# Altium schematic sheet Input_Output.SchDoc: Motherboard-Input_Output
size A4; Author: Patryk Bujak; DrawnBy: Patryk Bujak; DocumentNumber: 12; Revision: 1.0; SheetNumber: 4; SheetTotal: 10
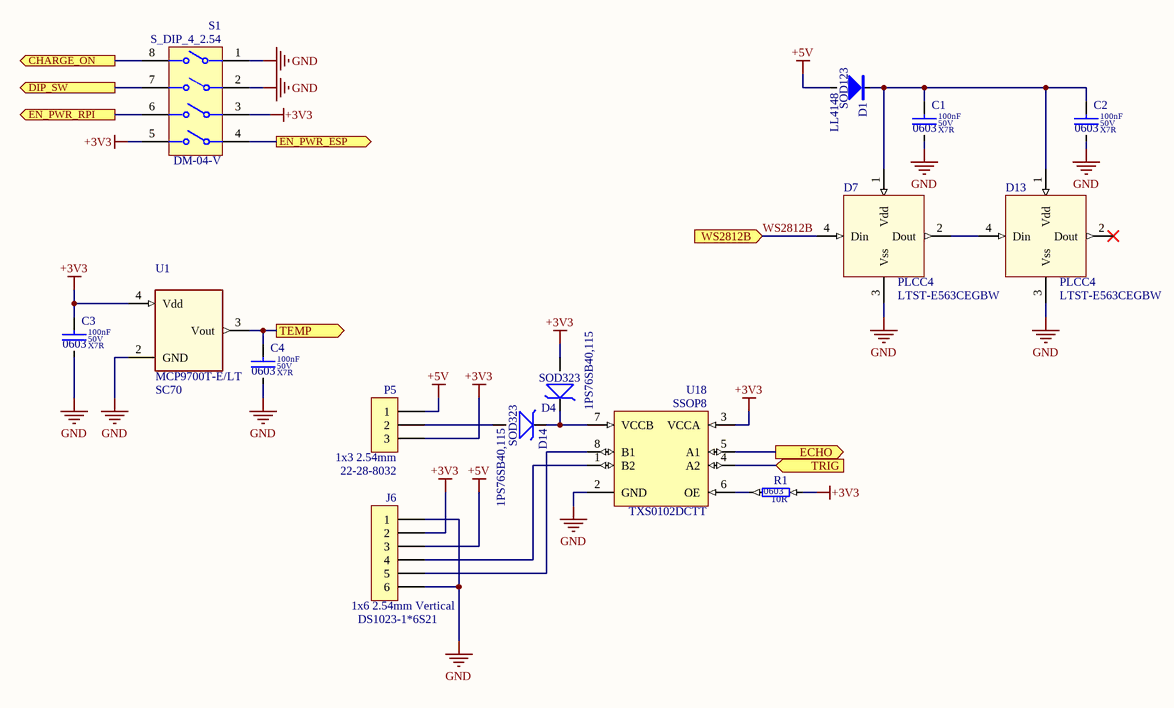
[diagram p0: Input_Output.SchDoc]

## Parts
C1  value 100nF  Dielectric: X7R  Voltage: 50V  SCH_Footprint: 0603  [C_0603_1608]  (hidden comment: Ceramic X7R)
C2  value 100nF  Dielectric: X7R  Voltage: 50V  SCH_Footprint: 0603  [C_0603_1608]  (hidden comment: Ceramic X7R)
C3  value 100nF  Dielectric: X7R  Voltage: 50V  SCH_Footprint: 0603  [C_0603_1608]  (hidden comment: Ceramic X7R)
C4  value 100nF  Dielectric: X7R  Voltage: 50V  SCH_Footprint: 0603  [C_0603_1608]  (hidden comment: Ceramic X7R)
D1  value LL4148  [SOD123]  (hidden comment: 1N4148W)
D4  value 1PS76SB40,115  [SOD323]  (hidden comment: 1PS76SB40)
D7  value LTST-E563CEGBW  SCH_Footprint: PLCC4  [PLCC4_5050]  (hidden comment: SMD LED with built-in embedded IC)
D13  value LTST-E563CEGBW  SCH_Footprint: PLCC4  [PLCC4_5050]  (hidden comment: SMD LED with built-in embedded IC)
D14  value 1PS76SB40,115  [SOD323]  (hidden comment: 1PS76SB40)
J6  value DS1023-1*6S21  SCH_Footprint: 1x6 2.54mm Vertical  [J_HEADER_1x6_2.54_VERTICAL]  (hidden comment: Goldpin female straight)
P5  value 22-28-8032  SCH_Footprint: 1x3 2.54mm  [P_HEADER_1x3_2.54_ANGLE]  (hidden comment: Goldpin)
R1  value 10R  SCH_Footprint: 0603  [R_0603_1608]  (hidden comment: Resistor)
S1  value DM-04-V  SCH_Footprint: S_DIP_4_2.54  [DM-04-V]  (hidden comment: DIP SWITCH 4 POS)
U1  SCH_Footprint: SC70  [SC70-5_SOT353_TSSOP5]  (hidden comment: MCP9700T-E/LT)
U18  value TXS0102DCTT  SCH_Footprint: SSOP8  [SSOP8_3x3]  (hidden comment: 2-Bit Bidirectional Voltage-Level Shifter for Open-Drain and Push-Pull Application 8-VSSOP -40 to 85)

## Ports
CHARGE_ON (out), DIP_SW (out), ECHO (out), EN_PWR_ESP (out), EN_PWR_RPI (out), TEMP (out), TRIG (in), WS2812B (in)

## Nets
+3V3: C3.1 D4.2 J6.2 P5.3 R1.1 S1.3 S1.5 U1.4(Vdd) U18.3(VCCA)
+5V: D1.2 J6.3 P5.1
GND: C1.2 C2.2 C3.2 C4.2 D7.3(Vss) D13.3(Vss) J6.1 J6.6 S1.1 S1.2 U1.2(GND) U18.2(GND)
CHARGE_ON: S1.8 ; port CHARGE_ON
DIP_SW: S1.7 ; port DIP_SW
ECHO: U18.5(A1) ; port ECHO
EN_PWR_ESP: S1.4 ; port EN_PWR_ESP
EN_PWR_RPI: S1.6 ; port EN_PWR_RPI
TEMP: C4.1 U1.3(Vout) ; port TEMP
TRIG: U18.4(A2) ; port TRIG
WS2812B: D7.4(Din) ; port WS2812B
NetC1_1: C1.1 C2.1 D1.1 D7.1(Vdd) D13.1(Vdd)
NetD4_1: D4.1 D14.1 U18.7(VCCB)
NetD7_2: D7.2(Dout) D13.4(Din)
NetD14_2: D14.2 P5.2
NetJ6_4: J6.4 U18.1(B2)
NetJ6_5: J6.5 U18.8(B1)
NetR1_2: R1.2 U18.6(OE)

Not connected (* = marked no-connect by the designer): D13 2(Dout)*

## Notes on the sheet
- Title
- Size:
- Date:
- A4
- Number:
- Time:
- Revision:
- Sheet
- of
- File:

## Library data of the parts
C1-C4 = C_100nF_50V_X7R_0603_5: Capacitor; Manufacturer: Samsung; Manufacturer Part Number: CL10B104JB8NNNC; Tolerance (%): 5; Part Number: C_100nF_50V_X7R_0603_5; HelpURL: http://www.tme.eu/pl/Document/4a42202b32dab16128fe107dd69598cc/samsung-chip-cap.pdf; Supplier 1: TME; Supplier Part Number 1: CL10B104JB8NNNC; Supplier 2: RS Components; Supplier Part Number 2: 7665455; Supplier 3: Farnell; Supplier 4: Mouser; Supplier 5: Digi-Key; Supplier Part Number 5: 1276-1033-1-ND; Supplier 6: LCSC; Supplier Part Number 6: C24452
D1 = D_1N4148W_0A15_75V_SOD123: Manufacturer: Fairchild Semiconductor; Voltage: 75V; Current: 0.15A; SCH_Footprint: SOD123; Part Number: D_1N4148W_0A15_75V_SOD123; Manufacturer Part Number: LL4148; Supplier 1: TME; Supplier 2: RS Components; Supplier 3: Farnell; Supplier 4: Mouser; Supplier Part Number 4: 771-PMLL4148L-T/R; Supplier 5: Digi-Key; Supplier Part Number 5: LL4148FSCT; Supplier 6: LCSC
D4 D14 = DS_1PS76SB40_40V_SOD323: Manufacturer: Nexperia; Voltage: 40V; Current: 120mA; SCH_Footprint: SOD323; Part Number: DS_1PS76SB40_40V_SOD323; HelpURL: https://datasheet.octopart.com/BAS40H%2C115-Nexperia-datasheet-8446890.pdf; Manufacturer Part Number: 1PS76SB40,115; Supplier 1: TME; Supplier Part Number 1: 1PS76SB40.115; Supplier 2: RS Components; Supplier Part Number 2: 509419; Supplier 3: Farnell; Supplier Part Number 3: 1349646; Supplier 4: Mouser; Supplier Part Number 4: 771-1PS76SB40115; Supplier 5: Digi-Key; Supplier Part Number 5: 1727-1187-1-ND; Supplier 6: LCSC
D7 D13 = OL_LTST-E563CEGBW: Manufacturer: Lite-On; Part Number: OL_LTST-E563CEGBW; HelpURL: https://www.tme.eu/Document/594934e57b4d934542266695a36c177d/AN500301_v3.0.pdf; Manufacturer Part Number: LTST-E563CEGBW; Supplier 1: TME; Supplier Part Number 1: LTST-E563CEGBW; Supplier 2: RS Components; Supplier 3: Farnell; Supplier 4: Mouser; Supplier Part Number 4: 859-LTST-E563CEGBW; Supplier 5: Digi-Key; Supplier Part Number 5: 160-2264-1-ND; Supplier 6: LCSC
J6 = J_HEADER_1x6_2.54_VERTICAL: Pin Header; Manufacturer: Connfly; Part Number: J_HEADER_1x6_2.54_VERTICAL; HelpURL: https://www.tme.eu/Document/584b1a60cf2e8809a936c5f5ff2de0d5/zl262-sg.pdf; Manufacturer Part Number: DS1023-1*6S21; Supplier 1: TME; Supplier Part Number 1: ZL262-6SG; Supplier 2: RS Components; Supplier 3: Farnell; Supplier 4: Mouser; Supplier 5: Digi-Key; Supplier 6: LCSC
P5 = P_HEADER_1x3_2.54_ANGLE: Pin Header; Manufacturer: Molex; Part Number: P_HEADER_1x3_2.54_ANGLE; HelpURL: https://datasheet.octopart.com/022288032-Molex-datasheet-8335722.pdf; Manufacturer Part Number: 22-28-8032; Supplier 1: TME; Supplier 2: RS Components; Supplier 3: Farnell; Supplier 4: Mouser; Supplier Part Number 4: 538-22-28-8032; Supplier 5: Digi-Key; Supplier Part Number 5: WM50015-03-ND; Supplier 6: LCSC
R1 = R_10R_0603_1: Manufacturer: Royalohm; Manufacturer Part Number: 0603SAF100JT5E; Voltage: 50V; Power: 100mW; Tolerance: 1%; Part Number: R_10R_0603_1; HelpURL: http://www.tme.eu/pl/Document/b315665a56acbc42df513c99b390ad98/ROYALOHM-THICKFILM.pdf; Supplier 1: TME; Supplier Part Number 1: SMD0603-10R-1%; Supplier 2: RS Components; Supplier 3: Farnell; Supplier 4: Mouser; Supplier 5: Digi-Key; Supplier 6: LCSC
S1 = S_DM-04-V: Manufacturer: DIPTRONICS; Part Number: S_DM-04-V; HelpURL: https://www.tme.eu/pl/Document/3859235cbbc3386afa52bad431a134f4/DM-SERIES.pdf; Manufacturer Part Number: DM-04-V; Supplier 1: TME; Supplier Part Number 1: ESD104E; Supplier 2: RS Components; Supplier 3: Farnell; Supplier 4: Mouser; Supplier Part Number 4: 113-DM04VTR; Supplier 5: Digi-Key; Supplier 6: LCSC
U1 = U_MCP9700T-E/LT: Manufacturer: Microchip; Part Number: U_MCP9700T-E/LT; Value: MCP9700T-E/LT; HelpURL: http://www.mouser.com/ds/2/268/20001942F-461622.pdf; Manufacturer Part Number: MCP9700T-E/LT; Supplier 1: TME; Supplier 2: RS Components; Supplier 3: Farnell; Supplier Part Number 3: 1084621; Supplier 4: Mouser; Supplier Part Number 4: 579-MCP9700T-E/LT; Supplier 5: Digi-Key; Supplier Part Number 5: MCP9700T-E/LTCT-ND; Supplier 6: LCSC
U18 = U_TXS0102DCTT: Manufacturer: Texas Instruments; Part Number: U_TXS0102DCTT; HelpURL: http://www.ti.com/lit/ds/symlink/txs0102.pdf; Manufacturer Part Number: TXS0102DCTT; Supplier 1: TME; Supplier 2: RS Components; Supplier Part Number 2: 7098912P; Supplier 3: Farnell; Supplier Part Number 3: 2098018; Supplier 4: Mouser; Supplier Part Number 4: 595-TXS0102DCTT; Supplier 5: Digi-Key; Supplier Part Number 5: 296-32603-1-ND; Supplier 6: LCSC